# EAGLE schematic bldc_octo (EAGLE 9.6.2)
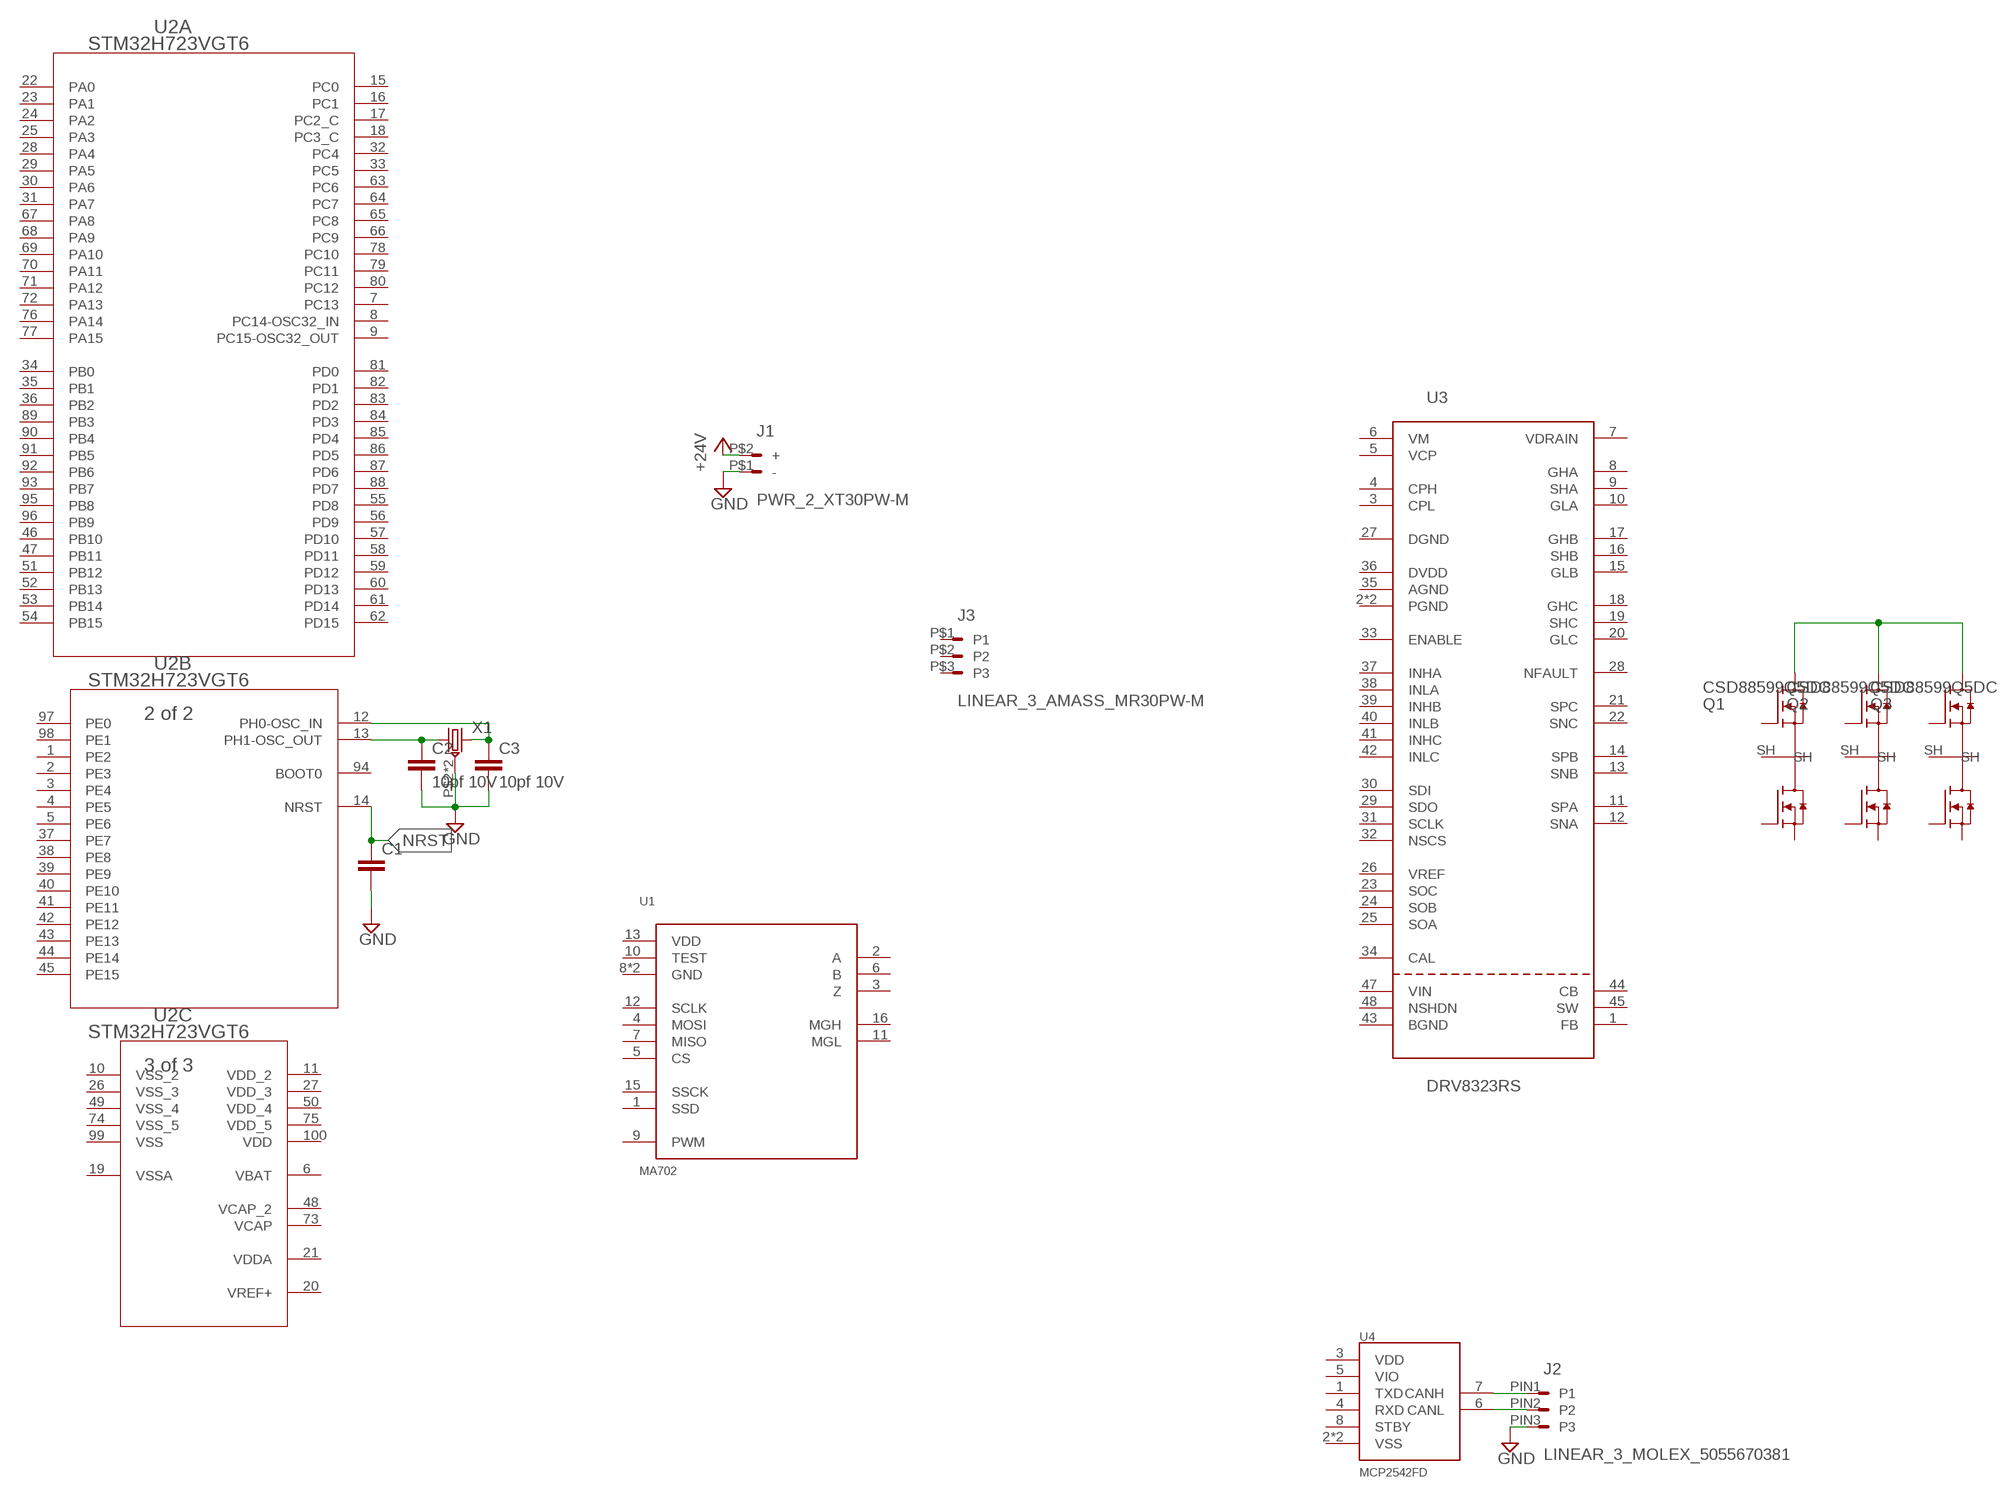
[diagram p0: schematic, sheet 1]

## Parts
C1  C0603  [C0603]
C2  10pf 10V  C0603  [C0603]
C3  10pf 10V  C0603  [C0603]
J1  PWR_2_XT30PW-M  [XT30PW-M]
J2  LINEAR_3_MOLEX_5055670381  [MOLEX_5055670381]
J3  LINEAR_3_AMASS_MR30PW-M  [MR30PW-M]
Q1  CSD88599Q5DC  [CSD88599Q5DC]
Q2  CSD88599Q5DC  [CSD88599Q5DC]
Q3  CSD88599Q5DC  [CSD88599Q5DC]
U1  MA702  [QFN-16_3X3]
U2  STM32H723VGT6  [LQFP100_STM]
U3  DRV8323RS  [VQFN-48_7X7]
U4  MCP2542FD  [TDFN_2X3]
X1  CRYSTAL_NX2016SA-24MHZ-EXS00A-CS11335  [NX201SA]

## Nets
+24V: J1.P$2(+)
GND: C1.2 C2.2 C3.2 J1.P$1(-) J2.PIN3(P3) X1.P$2(GND) X1.P$4(GND)
N$1: J2.PIN1(P1) U4.7(CANH)
N$2: J2.PIN2(P2) U4.6(CANL)
N$3: C2.1 U2.13(B:PH1-OSC_OUT) X1.P$1
N$4: C3.1 U2.12(B:PH0-OSC_IN) X1.P$3
N$5: Q1.VIN$1(V_IN) Q1.VIN$2(V_IN) Q1.VIN$3(V_IN) Q1.VIN$4(V_IN) Q1.VIN$5(V_IN) Q1.VIN$6(V_IN) Q1.VIN$7(V_IN) Q1.VIN$8(V_IN) Q1.VIN$9(V_IN) Q1.VIN$10(V_IN) Q1.VIN$11(V_IN) Q2.VIN$1(V_IN) Q2.VIN$2(V_IN) Q2.VIN$3(V_IN) Q2.VIN$4(V_IN) Q2.VIN$5(V_IN) Q2.VIN$6(V_IN) Q2.VIN$7(V_IN) Q2.VIN$8(V_IN) Q2.VIN$9(V_IN) Q2.VIN$10(V_IN) Q2.VIN$11(V_IN) Q3.VIN$1(V_IN) Q3.VIN$2(V_IN) Q3.VIN$3(V_IN) Q3.VIN$4(V_IN) Q3.VIN$5(V_IN) Q3.VIN$6(V_IN) Q3.VIN$7(V_IN) Q3.VIN$8(V_IN) Q3.VIN$9(V_IN) Q3.VIN$10(V_IN) Q3.VIN$11(V_IN)
NRST: C1.1 U2.14(B:NRST)
Unconnected: J1.P$3(GND) J1.P$4(GND) J2.MOUNT$1(GND) J2.MOUNT$2(GND) J3.P$1(P1) J3.P$2(P2) J3.P$3(P3) J3.SUP$2(GND) J3.SUP(GND) Q1.GH Q1.GL Q1.P_GND Q1.SH Q1.V_SW Q2.GH Q2.GL Q2.P_GND Q2.SH Q2.V_SW Q3.GH Q3.GL Q3.P_GND Q3.SH Q3.V_SW U1.1(SSD) U1.2(A) U1.3(Z) U1.4(MOSI) U1.5(CS) U1.6(B) U1.7(MISO) U1.8(GND) U1.9(PWM) U1.10(TEST) U1.11(MGL) U1.12(SCLK) U1.13(VDD) U1.14(NC) U1.15(SSCK) U1.16(MGH) U1.PAD(GND) U2.1(B:PE2) U2.2(B:PE3) U2.3(B:PE4) U2.4(B:PE5) U2.5(B:PE6) U2.7(A:PC13) U2.8(A:PC14-OSC32_IN) U2.9(A:PC15-OSC32_OUT) U2.15(A:PC0) U2.16(A:PC1) U2.17(A:PC2_C) U2.18(A:PC3_C) U2.22(A:PA0) U2.23(A:PA1) U2.24(A:PA2) U2.25(A:PA3) U2.28(A:PA4) U2.29(A:PA5) U2.30(A:PA6) U2.31(A:PA7) U2.32(A:PC4) U2.33(A:PC5) U2.34(A:PB0) U2.35(A:PB1) U2.36(A:PB2) U2.37(B:PE7) U2.38(B:PE8) U2.39(B:PE9) U2.40(B:PE10) U2.41(B:PE11) U2.42(B:PE12) U2.43(B:PE13) U2.44(B:PE14) U2.45(B:PE15) U2.46(A:PB10) U2.47(A:PB11) U2.51(A:PB12) U2.52(A:PB13) U2.53(A:PB14) U2.54(A:PB15) U2.55(A:PD8) U2.56(A:PD9) U2.57(A:PD10) U2.58(A:PD11) U2.59(A:PD12) U2.60(A:PD13) U2.61(A:PD14) U2.62(A:PD15) U2.63(A:PC6) U2.64(A:PC7) U2.65(A:PC8) U2.66(A:PC9) U2.67(A:PA8) U2.68(A:PA9) U2.69(A:PA10) U2.70(A:PA11) U2.71(A:PA12) U2.72(A:PA13) U2.76(A:PA14) U2.77(A:PA15) U2.78(A:PC10) U2.79(A:PC11) U2.80(A:PC12) U2.81(A:PD0) U2.82(A:PD1) U2.83(A:PD2) U2.84(A:PD3) U2.85(A:PD4) U2.86(A:PD5) U2.87(A:PD6) U2.88(A:PD7) U2.89(A:PB3) U2.90(A:PB4) U2.91(A:PB5) U2.92(A:PB6) U2.93(A:PB7) U2.94(B:BOOT0) U2.95(A:PB8) U2.96(A:PB9) U2.97(B:PE0) U2.98(B:PE1) U3.1(FB) U3.2(PGND) U3.3(CPL) U3.4(CPH) U3.5(VCP) U3.6(VM) U3.7(VDRAIN) U3.8(GHA) U3.9(SHA) U3.10(GLA) U3.11(SPA) U3.12(SNA) U3.13(SNB) U3.14(SPB) U3.15(GLB) U3.16(SHB) U3.17(GHB) U3.18(GHC) U3.19(SHC) U3.20(GLC) U3.21(SPC) U3.22(SNC) U3.23(SOC) U3.24(SOB) U3.25(SOA) U3.26(VREF) U3.27(DGND) U3.28(NFAULT) U3.29(SDO) U3.30(SDI) U3.31(SCLK) U3.32(NSCS) U3.33(ENABLE) U3.34(CAL) U3.35(AGND) U3.36(DVDD) U3.37(INHA) U3.38(INLA) U3.39(INHB) U3.40(INLB) U3.41(INHC) U3.42(INLC) U3.43(BGND) U3.44(CB) U3.45(SW) U3.46(NC) U3.47(VIN) U3.48(NSHDN) U3.PAD(PGND) U4.1(TXD) U4.2(VSS) U4.3(VDD) U4.4(RXD) U4.5(VIO) U4.8(STBY) U4.PAD(VSS)

## Power pins joined to a net without a drawn wire
VBAT: U2.6(C:VBAT)
VCAP: U2.73(C:VCAP)
VCAP_2: U2.48(C:VCAP_2)
VDD: U2.100(C:VDD)
VDD_2: U2.11(C:VDD_2)
VDD_3: U2.27(C:VDD_3)
VDD_4: U2.50(C:VDD_4)
VDD_5: U2.75(C:VDD_5)
VDDA: U2.21(C:VDDA)
VREF+: U2.20(C:VREF+)
VSS: U2.99(C:VSS)
VSS_2: U2.10(C:VSS_2)
VSS_3: U2.26(C:VSS_3)
VSS_4: U2.49(C:VSS_4)
VSS_5: U2.74(C:VSS_5)
VSSA: U2.19(C:VSSA)

## Library data of the parts
C1-C3 = _T_rcl:C
J1 = _T_conn:PWR_2
J2 J3 = _T_conn:LINEAR_3
Q1-Q3 = _T_transistors:CSD88599Q5DC
U1 = _T_ic:MA702; DATASHEET: https://www.monolithicpower.com/en/documentview/productdocument/index/version/2/document_type/Datasheet/lang/en/sku/MA702/
U2 = _T_ic:STM32H723VGT6; BUILT_BY: EMA_Jessica; COPYRIGHT: Copyright (C) 2018 Accelerated Designs. All rights reserved; MANUFACTURER_PART_NUMBER: STM32H723VGT6; SOURCELIBRARY: STMicroelectronics_2020-09-22_1; VENDOR: STMicroelectronics
U3 = _T_ic:DRV8323RS; DATASHEET: https://www.ti.com/lit/ds/symlink/drv8323r.pdf?ts=1587957100782
U4 = _T_ic:MCP2542FD
X1 = _T_ic:CRYSTAL